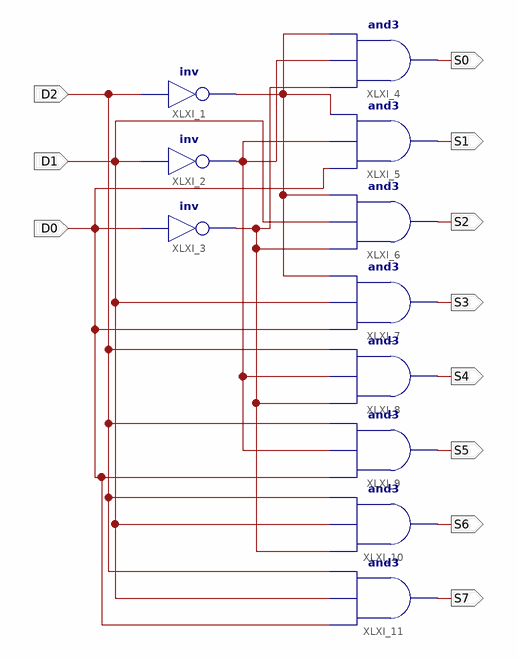
[diagram p0: schematic sheet 1]
// Xilinx ISE schematic Decoder3.sch (spartan3e) as structural Verilog: 11 symbols, 11 ports
module Decoder3 (
  input  D2,
  input  D1,
  input  D0,
  output S0,
  output S1,
  output S2,
  output S3,
  output S4,
  output S5,
  output S6,
  output S7
);

  wire XLXN_1, XLXN_30, XLXN_40;

  not XLXI_1 (XLXN_1, D2);
  not XLXI_2 (XLXN_30, D1);
  not XLXI_3 (XLXN_40, D0);
  and XLXI_4 (S0, XLXN_40, XLXN_30, XLXN_1);
  and XLXI_5 (S1, D0, XLXN_30, XLXN_1);
  and XLXI_6 (S2, XLXN_40, D1, XLXN_1);
  and XLXI_7 (S3, D0, D1, XLXN_1);
  and XLXI_8 (S4, XLXN_40, XLXN_30, D2);
  and XLXI_9 (S5, D0, XLXN_30, D2);
  and XLXI_10 (S6, XLXN_40, D1, D2);
  and XLXI_11 (S7, D0, D1, D2);
endmodule
